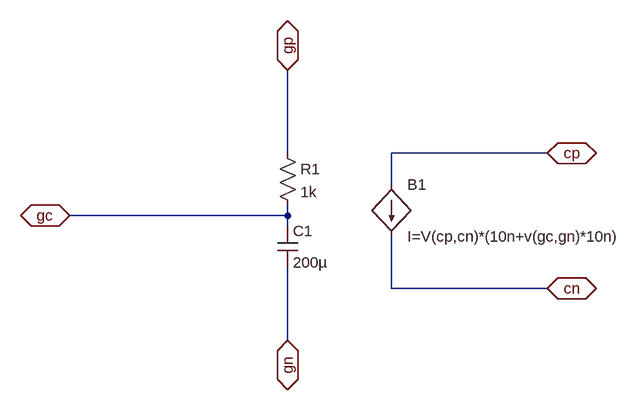
[diagram p0: schematic symbole.asc]
symbole.asc, the LTspice schematic file:
Version 4
SHEET 1 880 680
WIRE 16 80 16 -48
WIRE 416 80 176 80
WIRE 176 128 176 80
WIRE 16 176 16 160
WIRE 16 176 -320 176
WIRE 16 192 16 176
WIRE 176 288 176 208
WIRE 416 288 176 288
WIRE 16 368 16 256
FLAG 416 288 cn
IOPIN 416 288 BiDir
FLAG 416 80 cp
IOPIN 416 80 BiDir
FLAG 16 368 gn
IOPIN 16 368 BiDir
FLAG 16 -48 gp
IOPIN 16 -48 BiDir
FLAG -320 176 gc
IOPIN -320 176 BiDir
SYMBOL res 0 64 R0
SYMATTR InstName R1
SYMATTR Value 1k
SYMBOL cap 0 192 R0
SYMATTR InstName C1
SYMATTR Value 200µ
SYMBOL bi 176 128 R0
SYMATTR InstName B1
SYMATTR Value I=V(cp,cn)*(10n+v(gc,gn)*10n)

The netlist it stands for:
* symbole.asc
R1 gp gc 1k
C1 gc gn 200µ
B1 cp cn I=V(cp,cn)*(10n+v(gc,gn)*10n)
.backanno
.end